# EAGLE design SideSensor_PCB_v2 (EAGLE 9.7.0)
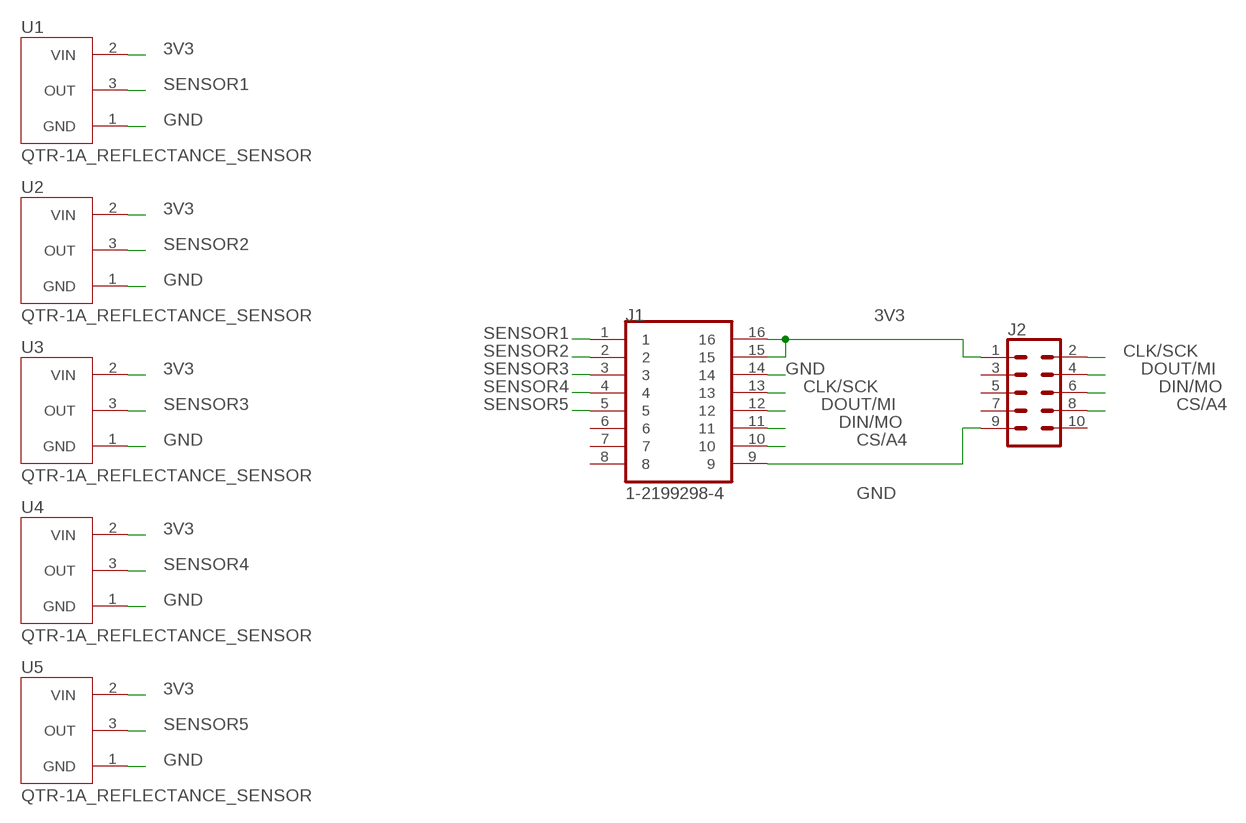
[diagram p0: schematic, sheet 1]

## Parts
J1  1-2199298-4  [TE_1-2199298-4]
J2  CONN_05X2PTH  [2X5]
U1  QTR-1A_REFLECTANCE_SENSOR  [SENSOR_QTR-1A_REFLECTANCE_SENSOR]
U2  QTR-1A_REFLECTANCE_SENSOR  [SENSOR_QTR-1A_REFLECTANCE_SENSOR]
U3  QTR-1A_REFLECTANCE_SENSOR  [SENSOR_QTR-1A_REFLECTANCE_SENSOR]
U4  QTR-1A_REFLECTANCE_SENSOR  [SENSOR_QTR-1A_REFLECTANCE_SENSOR]
U5  QTR-1A_REFLECTANCE_SENSOR  [SENSOR_QTR-1A_REFLECTANCE_SENSOR]

## Nets
3V3: J1.15 J1.16 J2.1 U1.2(VIN) U2.2(VIN) U3.2(VIN) U4.2(VIN) U5.2(VIN)
CLK/SCK: J1.13 J2.2
CS/A4: J1.10 J2.8
DIN/MO: J1.11 J2.6
DOUT/MI: J1.12 J2.4
GND: J1.9 J1.14 J2.9 U1.1(GND) U2.1(GND) U3.1(GND) U4.1(GND) U5.1(GND)
SENSOR1: J1.1 U1.3(OUT)
SENSOR2: J1.2 U2.3(OUT)
SENSOR3: J1.3 U3.3(OUT)
SENSOR4: J1.4 U4.3(OUT)
SENSOR5: J1.5 U5.3(OUT)
Unconnected: J1.6 J1.7 J1.8 J2.3 J2.5 J2.7 J2.10

## Library data of the parts
J1 = 16 pin IC Socket:1-2199298-4; MANUFACTURER: TE; PARTREV: A; STANDARD: Manufacturer Recommendations
J2 = SparkFun-Connectors:CONN_05X2: Multi connection point. Often used as Generic Header-pin footprint for 0.1 inch spaced/style header connections For AVR SPI programming port, see special device with nice symbol: "AVR_SPI_PROG_5x2.dev" You can populate with any combo of single row headers, but if you'd like an exact match, check these: 2x5 AVR ICSP Male Header <https://www.sparkfun.com/products/778> (PRT-00778) 2x5 Pin Shrouded Header <https://www.sparkfun.com/products/8506> (PRT-08506) On any of the 0.1 inch spaced packages, you can populate with these: Break Away Headers - Straight <https://www.sparkfun.com/products/116> (PRT-00116) Break Away Male Headers - Right Angle <https://www.sparkfun.com/products/553> (PRT-00553) Female Headers <https://www.sparkfun.com/products/115> (PRT-00115) Break Away Headers - Machine Pin <https://www.sparkfun.com/products/117> (PRT-00117) Break Away Female Headers - Swiss Machine Pin <https://www.sparkfun.com/products/743> (PRT-00743) Special note: the shrouded connector mates well with our 5x2 ribbon cables: 2x5 Pin IDC Ribbon Cable <https://www.sparkfun.com/products/8535> (PRT-08535); PROD_ID: CONN-08499; SF_ID: PRT-0778
U1-U5 = QTR-1A_REFLECTANCE_SENSOR:QTR-1A_REFLECTANCE_SENSOR: Check availability <https://pricing.snapeda.com/parts/QTR-1A%20REFLECTANCE%20SENSOR/Pololu/view-part?ref=eda>; AVAILABILITY: Not in stock; CHECK_PRICES: https://www.snapeda.com/parts/QTR-1A%20REFLECTANCE%20SENSOR/Pololu/view-part/?ref=eda; DESCRIPTION: QTR-1A series Phototransistor Sensor Evaluation Board; MF: Pololu; MP: QTR-1A REFLECTANCE SENSOR; PACKAGE: None; PRICE: None; SNAPEDA_LINK: https://www.snapeda.com/parts/QTR-1A%20REFLECTANCE%20SENSOR/Pololu/view-part/?ref=snap

## Board
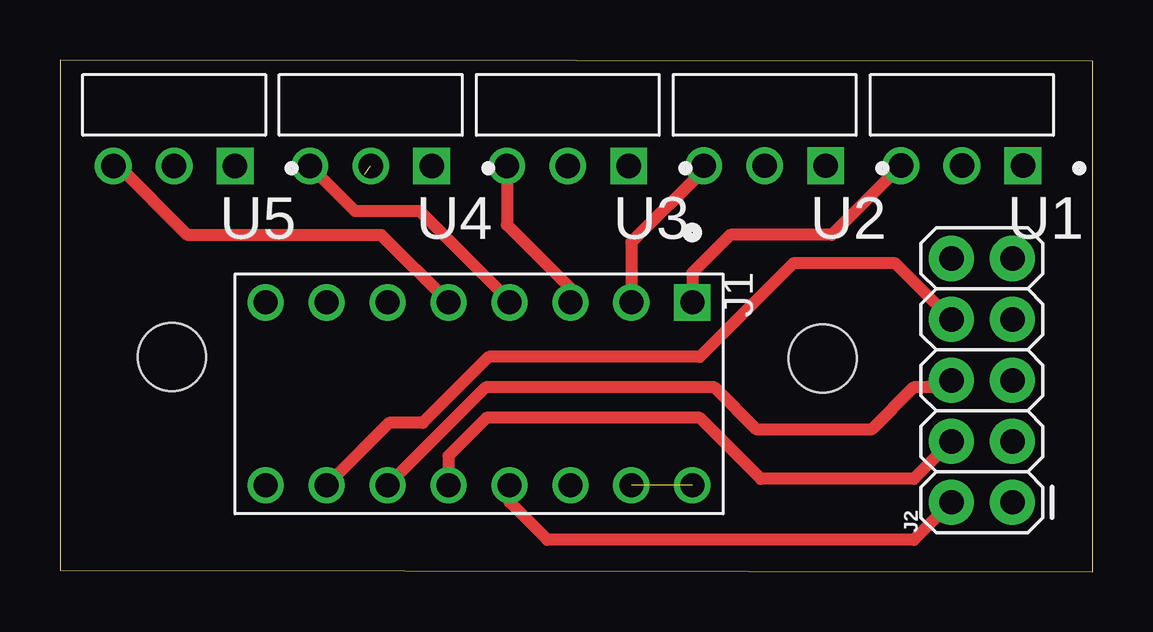
[diagram p1: board, top side]
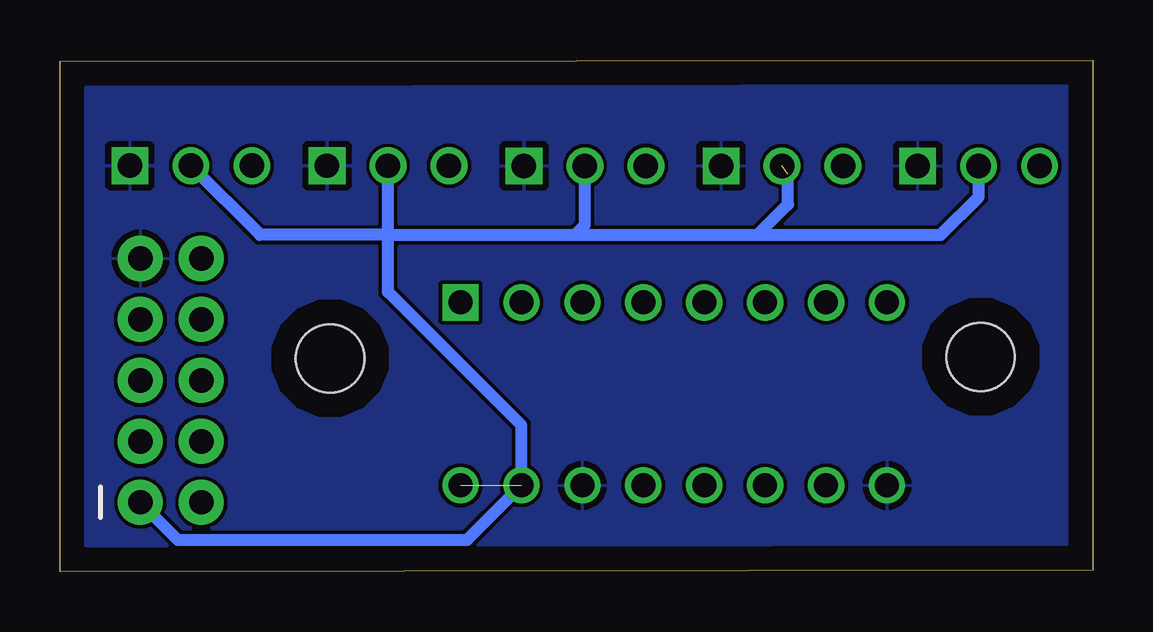
[diagram p2: board, bottom side, seen from below]

Size 43.05 x 21.31 mm. Coordinates in mm from the lower left corner, seen from the top.
Outline: 0,0.05 43.05,0 43.05,21.26 0,21.31 0,0.05
Copper layers (1*16): Top / Bottom
Stack-up Default Layer Stack: Top User Defined 0.035mm / Dielectric-1 User Defined 1.5mm / Bottom User Defined 0.035mm
Design rules: minimum copper width 6mil, minimum drill size 0.35mm, copper clearance wire_polygon to wire_polygon 6mil, copper clearance wire_polygon to pad_smd 6mil, copper clearance wire_polygon to via 6mil, copper clearance pad_smd to pad_smd 6mil, copper clearance pad_smd to via 6mil, copper clearance via to via 6mil, copper clearance smd to pad (same net) 6mil, copper clearance smd to via (same net) 6mil, copper clearance smd to smd (same net) 6mil, dimension clearance 40mil, via restrict clearance 0mil, restrict clearance 0mil, drill distance 6mil, keepout clearance 0mil
Holes 2.84 mm at 31.79,8.88 4.67,8.95

### Footprints (pad centres in the part's own frame; a part is rotated, then mirrored left to right if it is on the bottom)
TE_1-2199298-4 = drill 1 square: 1 -3.81,8.89 | drill 1: 2 -3.81,6.35; 3 -3.81,3.81; 4 -3.81,1.27; 5 -3.81,-1.27; 6 -3.81,-3.81; 7 -3.81,-6.35; 8 -3.81,-8.89; 9 3.81,-8.89; 10 3.81,-6.35; 11 3.81,-3.81; 12 3.81,-1.27; 13 3.81,1.27; 14 3.81,3.81; 15 3.81,6.35; 16 3.81,8.89
2X5 = drill 1.016 pad 1.88: 1 0,0; 2 0,2.54; 3 2.54,0; 4 2.54,2.54; 5 5.08,0; 6 5.08,2.54; 7 7.62,0; 8 7.62,2.54; 9 10.16,0; 10 10.16,2.54
SENSOR_QTR-1A_REFLECTANCE_SENSOR = drill 1.02 square: 1 -2.54,2.54 | drill 1.02: 2 0,2.54; 3 2.54,2.54

### Placement (x,y rotation side)
J1  17.47,7.4 270 top
J2  39.7,2.89 90 top
U1  37.6,19.45 180 top
U2  29.38,19.45 180 top
U3  21.17,19.44 180 top
U4  12.95,19.44 180 top
U5  4.76,19.44 180 top

### Tracks (layer width: path | path; a pad name or v marks a point on that pad's centre or on a via)
3V3  (2 unrouted)
  Bottom 0.508: J2.1 38.14,1.32 26.08,1.32 J1.15 23.82,6.09 29.38,11.65 29.38,14.02 | 29.38,14.02 U2.2 | 29.38,14.02 21.59,14.02 | 21.59,14.02 21.17,14.45 U3.2 | 21.59,14.02 13.97,14.02 | 13.97,14.02 12.7,15.29 12.7,16.56 | 13.97,14.02 6.35,14.02 4.76,15.62 U5.2 | 29.38,14.02 34.71,14.02 U1.2
CLK/SCK
  Top 0.508: J2.2 35.6,1.32 20.32,1.32 18.74,2.91 J1.13
CS/A4
  Top 0.508: J1.10 13.72,6.19 15.12,6.19 17.88,8.94 26.67,8.94 30.57,12.84 34.83,12.84 J2.8
DIN/MO
  Top 0.508: J2.6 36.87,7.67 35.58,7.67 33.82,5.92 29.05,5.92 27.3,7.67 17.74,7.67 J1.11
DOUT/MI
  Top 0.508: J2.4 35.6,3.86 29.21,3.86 26.67,6.4 17.78,6.4 16.2,4.82 J1.12
GND
  pour Bottom: 0.27,21.21 42.5,21.21 42.55,21.16 42.55,0.41 42.59,0.36 0.49,0.36 0.45,0.4 0.45,21.18 0.41,21.22 0.41,21.22
SENSOR1
  Top 0.508: U1.3 32.17,14.02 27.94,14.02 26.36,12.44 J1.1
SENSOR2
  Top 0.508: U2.3 26.84,16.73 23.82,13.71 J1.2
SENSOR3
  Top 0.508: U3.3 18.63,14.45 21.28,11.8 J1.3
SENSOR4
  Top 0.508: U4.3 12.29,15.03 14.99,15.03 18.74,11.28 J1.4
SENSOR5
  Top 0.508: U5.3 2.44,16.9 5.33,14.02 13.39,14.02 J1.5